# EAGLE design hoppercontroller (EAGLE 8.2.1)
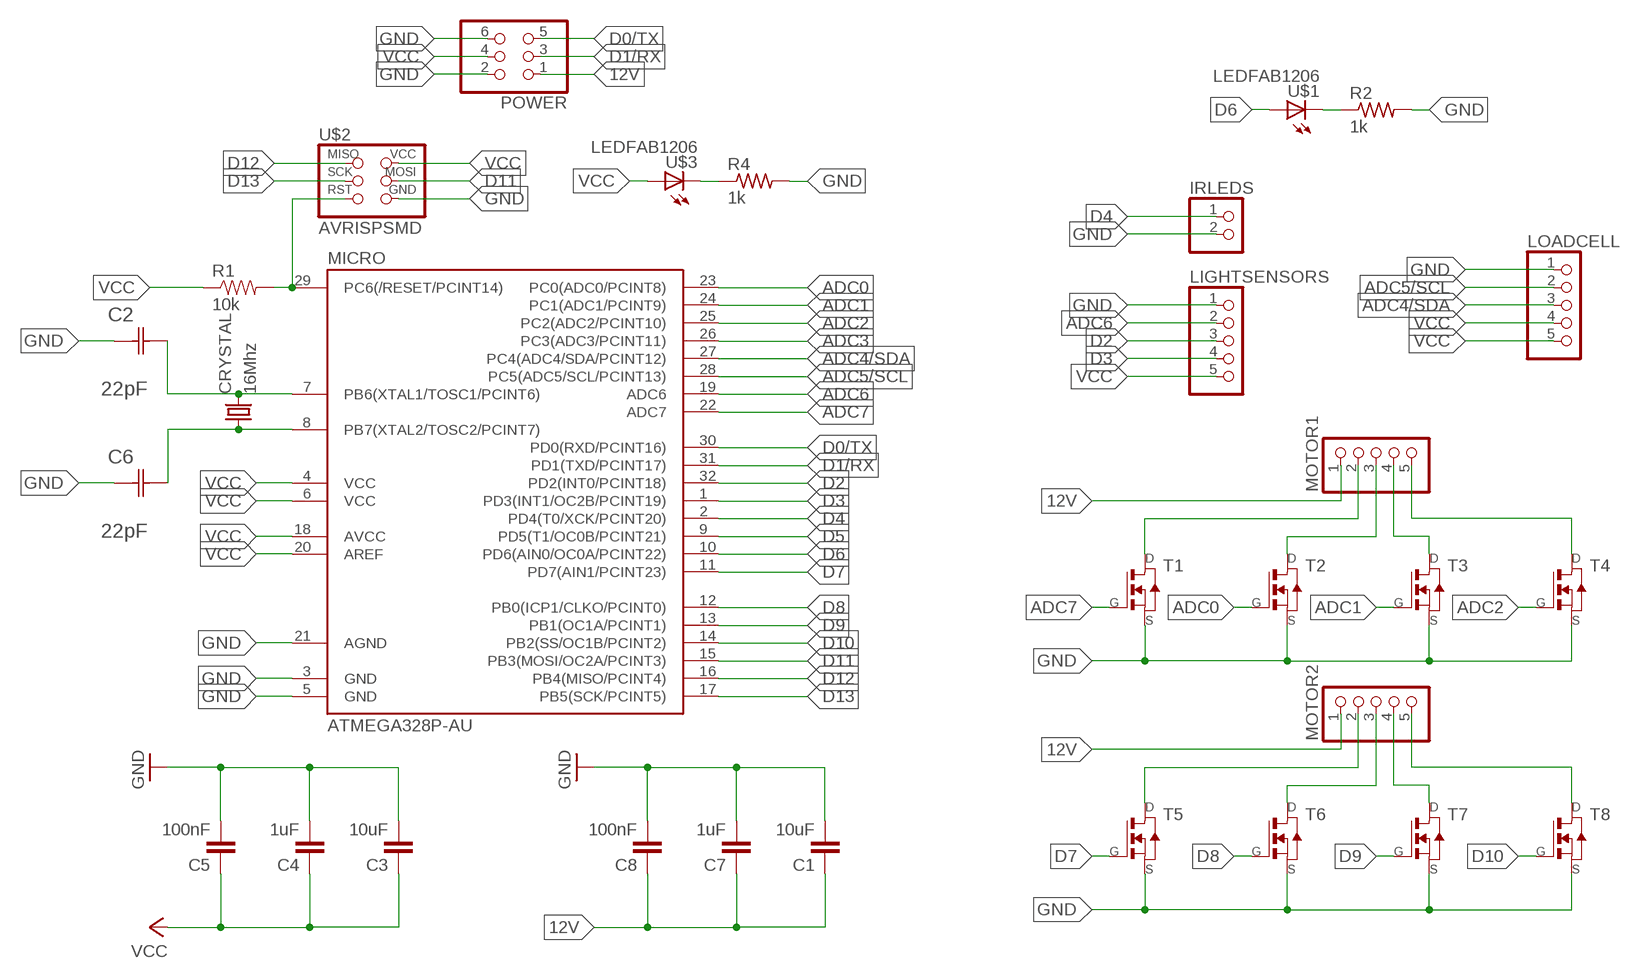
[diagram p0: schematic, sheet 1]

## Parts
C1  10uF  CAP1206  [1206]
C2  22pF  0612ZC225MAT2A  [CAPC3216X178N]
C3  10uF  CAP1206  [1206]
C4  1uF  CAP1206  [1206]
C5  100nF  CAP1206  [1206]
C6  22pF  0612ZC225MAT2A  [CAPC3216X178N]
C7  1uF  CAP1206  [1206]
C8  100nF  CAP1206  [1206]
CRYSTAL  16Mhz  CSM-7X-DU  [CSM-7X-DU]
IRLEDS  PINHD-1X2  [1X02]
LIGHTSENSORS  PINHD-1X5  [1X05]
LOADCELL  PINHD-1X5  [1X05]
MICRO  ATMEGA328P-AU  ATMEGA48/88/168-AU  [TQFP32-08]
MOTOR1  PINHD-1X5  [1X05]
MOTOR2  PINHD-1X5  [1X05]
POWER  PINHD-2X3-SMD  [2X03SMD]
R1  10k  RESISTOR1206  [1206]
R2  1k  RES-US1206FAB  [R1206FAB]
R4  1k  RES-US1206FAB  [R1206FAB]
T1  NMOSFETTO252  [TO252]
T2  NMOSFETTO252  [TO252]
T3  NMOSFETTO252  [TO252]
T4  NMOSFETTO252  [TO252]
T5  NMOSFETTO252  [TO252]
T6  NMOSFETTO252  [TO252]
T7  NMOSFETTO252  [TO252]
T8  NMOSFETTO252  [TO252]
U$1  LEDFAB1206  [LED1206FAB]
U$2  AVRISPSMD  [2X03SMD]
U$3  LEDFAB1206  [LED1206FAB]

## Nets
12V: C1.1 C7.1 C8.1 MOTOR1.1 MOTOR2.1 POWER.1
ADC0: MICRO.23(PC0(ADC0/PCINT8)) T2.1(G)
ADC1: MICRO.24(PC1(ADC1/PCINT9)) T3.1(G)
ADC2: MICRO.25(PC2(ADC2/PCINT10)) T4.1(G)
ADC3: MICRO.26(PC3(ADC3/PCINT11))
ADC4/SDA: LOADCELL.3 MICRO.27(PC4(ADC4/SDA/PCINT12))
ADC5/SCL: LOADCELL.2 MICRO.28(PC5(ADC5/SCL/PCINT13))
ADC6: LIGHTSENSORS.2 MICRO.19(ADC6)
ADC7: MICRO.22(ADC7) T1.1(G)
D0/TX: MICRO.30(PD0(RXD/PCINT16)) POWER.5
D1/RX: MICRO.31(PD1(TXD/PCINT17)) POWER.3
D2: LIGHTSENSORS.3 MICRO.32(PD2(INT0/PCINT18))
D3: LIGHTSENSORS.4 MICRO.1(PD3(INT1/OC2B/PCINT19))
D4: IRLEDS.1 MICRO.2(PD4(T0/XCK/PCINT20))
D5: MICRO.9(PD5(T1/OC0B/PCINT21))
D6: MICRO.10(PD6(AIN0/OC0A/PCINT22)) U$1.1(A)
D7: MICRO.11(PD7(AIN1/PCINT23)) T5.1(G)
D8: MICRO.12(PB0(ICP1/CLKO/PCINT0)) T6.1(G)
D9: MICRO.13(PB1(OC1A/PCINT1)) T7.1(G)
D10: MICRO.14(PB2(SS/OC1B/PCINT2)) T8.1(G)
D11: MICRO.15(PB3(MOSI/OC2A/PCINT3)) U$2.4(MOSI)
D12: MICRO.16(PB4(MISO/PCINT4)) U$2.1(MISO)
D13: MICRO.17(PB5(SCK/PCINT5)) U$2.3(SCK)
GND: C1.2 C2.1(C1) C3.2 C4.2 C5.2 C6.1(C1) C7.2 C8.2 IRLEDS.2 LIGHTSENSORS.1 LOADCELL.1 MICRO.3(GND) MICRO.5(GND) MICRO.21(AGND) POWER.2 POWER.6 R2.2 R4.2 T1.2(S) T2.2(S) T3.2(S) T4.2(S) T5.2(S) T6.2(S) T7.2(S) T8.2(S) U$2.6(GND)
N$1: MOTOR2.3 T6.3(D)
N$2: MOTOR1.3 T2.3(D)
N$3: MICRO.29(PC6(/RESET/PCINT14)) R1.2 U$2.5(RST)
N$4: C2.2(C2) CRYSTAL.2 MICRO.7(PB6(XTAL1/TOSC1/PCINT6))
N$5: MOTOR1.2 T1.3(D)
N$6: MOTOR1.4 T3.3(D)
N$7: R4.1 U$3.2(C)
N$8: MOTOR1.5 T4.3(D)
N$9: MOTOR2.2 T5.3(D)
N$10: MOTOR2.4 T7.3(D)
N$11: MOTOR2.5 T8.3(D)
N$12: C6.2(C2) CRYSTAL.1 MICRO.8(PB7(XTAL2/TOSC2/PCINT7))
N$13: R2.1 U$1.2(C)
VCC: C3.1 C4.1 C5.1 LIGHTSENSORS.5 LOADCELL.4 LOADCELL.5 MICRO.4(VCC) MICRO.6(VCC) MICRO.18(AVCC) MICRO.20(AREF) POWER.4 R1.1 U$2.2(VCC) U$3.1(A)

## Library data of the parts
C1 C3-C5 C7 C8 = 01_SparkFun:CAP: Capacitor Standard 0603 ceramic capacitor, and 0.1" leaded capacitor.
C2 C6 = AVX_By_element14_Batch_1:0612ZC225MAT2A: Capacitor 1206; MPN: 0612ZC225MAT2A; OC_FARNELL: -; OC_NEWARK: 12N3209; SUPPLIER: AVX; TOLERANCE: ±20%; VALUE: 2.2µF; VOLTAGERATING: 10V
CRYSTAL = 01_FAB_Hello:CSM-7X-DU: SMD CRYSTAL Source: www.ecsxtal.com .. Crystal 3.6864MHz CSM_7X_DU.PDF; OC_FARNELL: unknown; OC_NEWARK: unknown
IRLEDS = pinhead:PINHD-1X2: PIN HEADER
LIGHTSENSORS LOADCELL MOTOR1 MOTOR2 = pinhead:PINHD-1X5: PIN HEADER
MICRO = atmega8:ATMEGA48/88/168
POWER = fab:PINHD-2X3-SMD: PIN HEADER
R1 = 01_SparkFun:RESISTOR: Resistor Basic schematic elements and footprints for 0603, 1206, and PTH 1/10th watt (small) resistors.
R2 R4 = fab:RES-US: Resistor (US Symbol) Variants with postfix FAB are widened to allow the routing of internal traces
T1-T8 = fab:NMOSFET: MOS FET
U$1 U$3 = fab:LED: LED
U$2 = fab:AVRISP

## Board
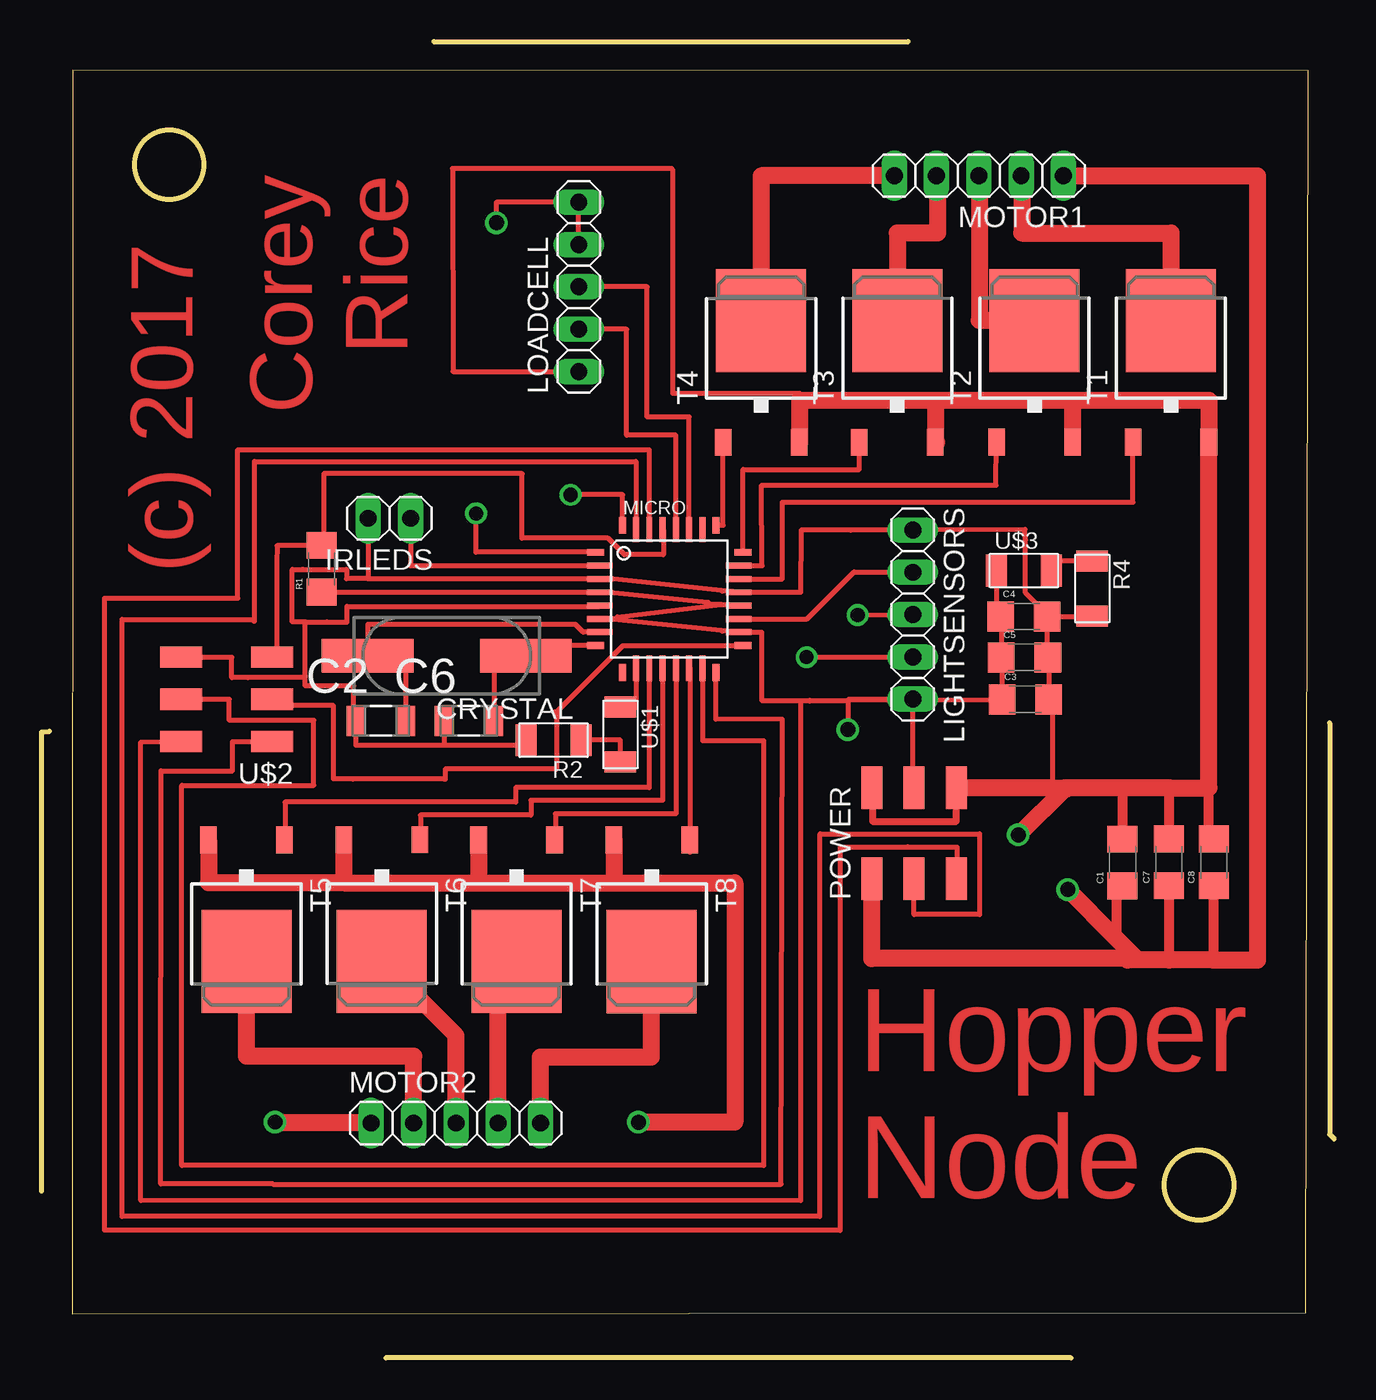
[diagram p1: board, top side]
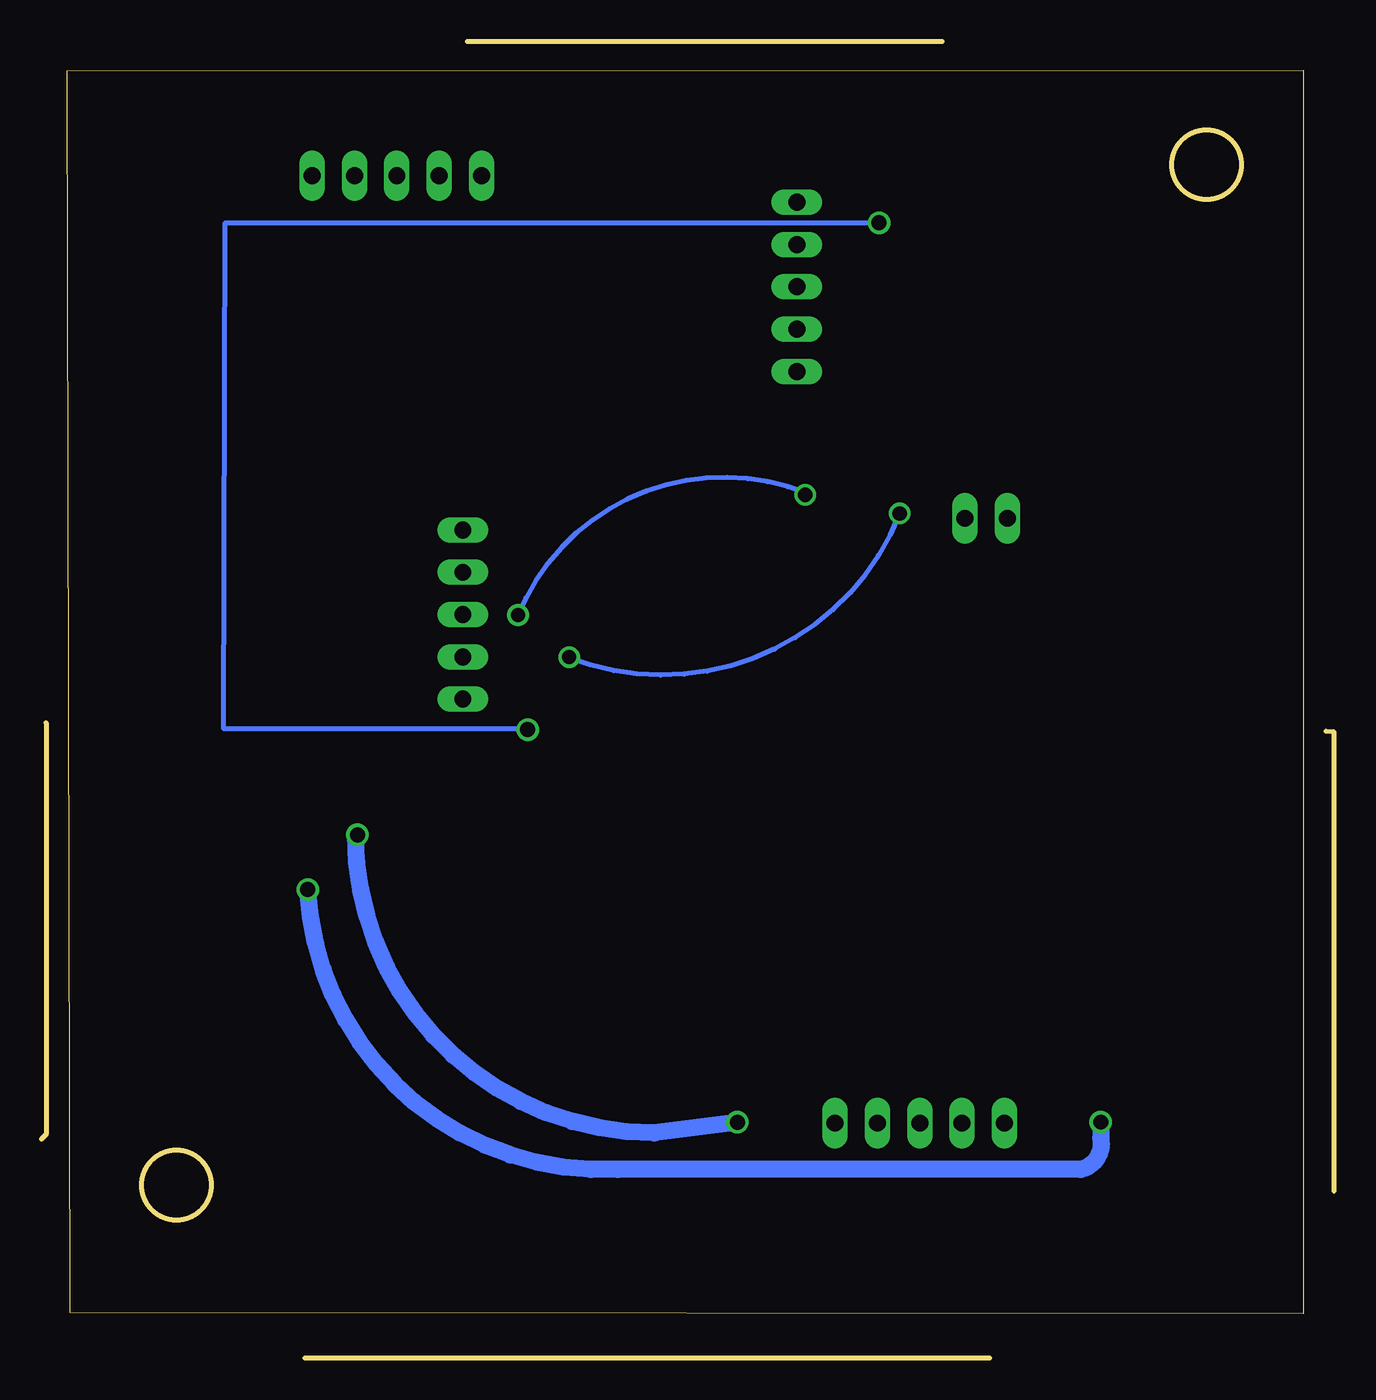
[diagram p2: board, bottom side, seen from below]

Size 77.6 x 79.03 mm. Coordinates in mm from the lower left corner, seen from the top.
Outline: 23.54,79.03 52.03,79.03
Outline: 77.33,38.13 77.33,13.41 77.6,13.15
Outline: 61.81,0 20.66,0
Outline: 0,10.02 0,37.57 0.48,37.62
Outline: 1.84,2.65 75.89,2.71 76.05,77.29 1.86,77.3 1.84,2.65
Outline: circle at 7.66,71.64 radius 2.08
Outline: circle at 69.5,10.38 radius 2.08
Copper layers (1*16): Top 0.035mm / dielectric 1.5mm / Bottom 0.035mm
Design rules "default *": minimum track width 12mil, minimum drill 24mil, track to track 16mil, track to pad 16mil, pad to pad 16mil, via to via 16mil, smd to smd 16mil, copper to edge 40mil, drill to drill 8mil, minimum pad ring 10mil, minimum via ring 8mil, stop-mask expansion 4mil, vias tented up to drill 0mil, thermal gap 10mil

### Footprints (pad centres in the part's own frame; a part is rotated, then mirrored left to right if it is on the bottom)
1206 = smd 1.6 x 1.8: 1 -1.4,0; 2 1.4,0
CAPC3216X178N = smd 1.118 x 1.803: 1 -1.499,0; 2 1.499,0
CSM-7X-DU = smd 5.5 x 2: 1 -4.75,0; 2 4.75,0
1X02 = drill 1.016 long: 1 -1.27,0; 2 1.27,0
1X05 = drill 1.016 long: 1 -5.08,0; 2 -2.54,0; 3 0,0; 4 2.54,0; 5 5.08,0
TQFP32-08 = smd 1.016 x 0.406: 1 -4.42,2.8; 8 -4.42,-2.8; 17 4.42,-2.8; 24 4.42,2.8 | smd 1.524 x 0.356: 2 -4.166,2; 3 -4.166,1.2; 4 -4.166,0.4; 5 -4.166,-0.4; 6 -4.166,-1.2; 7 -4.166,-2; 18 4.166,-2; 19 4.166,-1.2; 20 4.166,-0.4; 21 4.166,0.4; 22 4.166,1.2; 23 4.166,2 | smd 0.406 x 1.016: 9 -2.8,-4.42; 16 2.8,-4.42; 25 2.8,4.42; 32 -2.8,4.42 | smd 0.356 x 1.524: 10 -2,-4.166; 11 -1.2,-4.166; 12 -0.4,-4.166; 13 0.4,-4.166; 14 1.2,-4.166; 15 2,-4.166; 26 2,4.166; 27 1.2,4.166; 28 0.4,4.166; 29 -0.4,4.166; 30 -1.2,4.166; 31 -2,4.166
2X03SMD = smd 2.54 x 1.27: 1 -2.54,2.54; 2 2.92,2.54; 3 -2.54,0; 4 2.92,0; 5 -2.54,-2.54; 6 2.92,-2.54
R1206FAB = smd 1.27 x 1.905: 1 -1.651,0; 2 1.651,0
TO252 = smd 1 x 1.6: 1 -2.28,-4.8; 2 2.28,-4.8 | smd 5.4 x 6.2: 3 0,2.5
LED1206FAB = smd 1.27 x 1.905: 1 -1.651,0; 2 1.651,0

### Placement (x,y rotation side)
C1  64.9,29.74 90 top
C2  20.37,38.24 0 top
C3  59.06,39.54 0 top
C4  58.98,44.51 0 top
C5  59.02,42.06 0 top
C6  25.65,38.24 0 top
C7  67.68,29.75 90 top
C8  70.38,29.75 90 top
CRYSTAL  24.33,42.16 180 top
IRLEDS  20.88,50.41 180 top
LIGHTSENSORS  52.31,44.63 270 top
LOADCELL  32.25,64.31 90 top
MICRO  37.68,45.57 0 top
MOTOR1  56.27,70.98 180 top
MOTOR2  24.87,14.1 0 top
POWER  52.38,31.31 90 top
R1  16.81,47.38 90 top
R2  30.74,37.09 180 top
R4  63.08,46.18 270 top
T1  67.8,59.78 0 top
T2  59.61,59.78 0 top
T3  51.38,59.78 0 top
T4  43.2,59.77 0 top
T5  12.3,26.3 180 top
T6  20.42,26.3 180 top
T7  28.51,26.3 180 top
T8  36.63,26.29 180 top
U$1  34.75,37.42 270 top
U$2  11.3,39.54 180 top
U$3  58.97,47.27 0 top

### Tracks (layer width: path | path; a pad name or v marks a point on that pad's centre or on a via)
12V  (via drill 0.9)
  Top 0.61: C1.1 64.54,28.34 64.54,25.17 | C7.1 67.69,28.35 67.69,23.89 | C8.1 70.33,28.35 70.33,23.89
  Top 1.016: 65.21,23.98 65.72,23.98 | 65.21,23.98 49.84,23.98 POWER.1 | MOTOR2.1 14.07,14.1 arc-90 v14.01,14.16 | 65.46,24.25 arc90 65.72,23.98 | 65.21,23.98 65.21,23.89 67.69,23.89 70.33,23.89 73,23.89 73,70.98 MOTOR1.1 | 65.72,23.98 64.54,25.17 v61.61,28.11
  Bottom 1.016: v14.01,14.16 14.01,13.19 arc90 15.22,11.32 42.99,11.32 arc90 v61.61,28.11
ADC0
  Top 0.305: MICRO.23 43.25,47.57 43.23,52.4 57.31,52.4 T2.1
ADC1
  Top 0.305: MICRO.24 42.12,48.37 42.12,53.34 49.1,53.34 T3.1
ADC2
  Top 0.305: MICRO.25 40.92,49.99 T4.1
ADC4/SDA
  Top 0.305: MICRO.27 38.88,56.5 36.36,56.5 36.36,64.31 LOADCELL.3
ADC5/SCL
  Top 0.305: MICRO.28 38.08,55.4 35.13,55.4 35.13,61.77 LOADCELL.2
ADC6
  Top 0.305: MICRO.19 45.95,44.37 48.77,47.19 52.31,47.19 LIGHTSENSORS.2
ADC7
  Top 0.305: MICRO.22 44.47,46.77 44.47,51.38 65.52,51.38 T1.1
D0/TX
  Top 0.305: MICRO.30 36.48,54.52 11.77,54.52 11.77,45.61 3.77,45.61 3.78,7.67 47.96,7.65 47.96,30.68 52,30.69 54.96,30.67 POWER.5
D1/RX
  Top 0.305: MICRO.31 35.68,53.82 12.78,53.82 12.78,44.23 12.74,44.23 12.74,44.34 4.83,44.34 4.84,8.49 46.72,8.49 46.73,31.46 56.31,31.46 56.31,26.62 52.38,26.62 POWER.3
D2  (via drill 0.85 pad 1.3)
  Top 0.305: MICRO.32 34.88,51.82 v31.75,51.82 | v49,44.6 LIGHTSENSORS.3
  Bottom 0.305: v31.75,51.82 31.63,51.89 arc-90 49.04,44.51 49.1,44.46 arc-90 v49,44.6
D3  (via drill 0.85 pad 1.3)
  Top 0.305: MICRO.1 26.08,48.37 v26.08,50.7 | v45.93,42.07 LIGHTSENSORS.4
  Bottom 0.305: v26.08,50.7 arc90 45.97,42.06 v45.93,42.07
D4
  Top 0.305: IRLEDS.1 22.15,47.61 22.14,47.57 MICRO.2
D6
  Top 0.305: MICRO.10 35.68,39.07 U$1.1
D7
  Top 0.305: MICRO.11 36.48,34.24 28.46,34.24 28.46,33.37 14.61,33.37 14.61,31.1 T5.1
D8
  Top 0.305: MICRO.12 37.28,33.48 29.38,33.48 29.38,32.6 22.74,32.6 22.74,31.1 T6.1
D9
  Top 0.305: MICRO.13 38.08,32.67 30.84,32.67 30.84,31.1 T7.1
D10
  Top 0.305: MICRO.14 38.94,41.4 38.94,30.36 38.91,30.36 T8.1
D11
  Top 0.305: 39.72,41.4 MICRO.15 39.68,37.06 43.34,37.06 43.34,11.55 8.42,11.55 8.42,34.37 16.33,34.37 16.33,38.28 11.27,38.28 11.27,39.54 U$2.4
D12
  Top 0.305: 40.52,41.15 MICRO.16 40.48,38.35 44.47,38.34 44.4,10.42 13.9,10.43 13.9,10.44 7.15,10.44 7.18,35.24 11.47,35.24 11.47,37 | 11.47,37 | 11.47,37 U$2.1
D13
  Top 0.305: 13.27,39.58 13.32,39.54 U$2.3 13.84,39.16 17.53,39.16 17.53,34.76 18.68,34.75 24.22,34.75 | 24.19,34.77 24.14,34.76 24.22,34.75 | MICRO.17 34.88,42.75 30.91,38.79 | 30.91,38.79 30.81,38.79 | 30.91,38.79 30.91,35.35 24.22,35.35 24.22,34.75
GND  (via drill 0.9)
  Top 0.305: MICRO.21 | 15.82,40.94 15.82,40.86 12.38,40.84 11.41,40.85 11.41,42.06 8.4,42.06 U$2.6 | 15.82,40.94 15.82,44.18 | 15.82,44.18 17.14,44.18 18.33,44.18 18.33,45.11 33.45,45.1 MICRO.5 | 15.82,44.18 15.04,44.18 15.05,47.34 15.66,47.34 15.68,47.34 18.3,47.33 18.3,46.78 19.6,46.78 | 19.6,46.78 33.52,46.78 | MICRO.3 33.52,46.78 | MICRO.21 41.24,46.03 40.85,46.03 40.81,46.08 34.07,46.78 33.52,46.78 | C3.2 60.46,42.06 C5.2 60.38,42.06 C4.2 | C3.2 60.52,39.54 | C6.1 24.16,36.78 | 24.16,36.78 18.87,36.78 C2.1 18.74,38.25 18.74,40.35 15.82,40.35 15.82,40.94 | C4.2 60.38,44.62 59.06,45.93 59.06,49.12 59.05,49.75 48.58,49.69 | 48.58,49.69 45.59,49.69 45.57,45.96 MICRO.21 | C4.2 63.08,44.51 R4.2 | IRLEDS.2 19.6,46.78 | LIGHTSENSORS.1 48.58,49.69 | 48.58,49.69 | C3.2 60.49,39.54 | C3.2 60.68,39.54 60.68,34.23 | 45.52,57.5 45.52,57.9 37.9,57.9 37.9,71.34 37.85,71.34 37.82,71.4 24.66,71.4 24.69,59.23 LOADCELL.1 | R2.2 29.09,36.78 24.16,36.78
  Top 0.406: POWER.2 49.89,34.19 49.89,32.22 54.92,32.22 POWER.6
  Top 0.61: C1.2 64.92,31.14 64.92,34.23 | C7.2 67.72,31.15 67.72,34.23 | C8.2 70.08,31.15 70.08,34.23
  Top 1.016: 45.5,54.97 T4.2 45.52,54.97 45.52,57.5 53.66,57.5 | 53.74,54.98 T3.2 53.66,57.5 | 61.5,34.23 60.68,34.23 POWER.6 | T5.2 10.02,28.52 18.14,28.52 | 18.14,28.52 26.23,28.52 | 26.23,28.52 34.4,28.52 | 34.4,28.52 34.4,31.09 T8.2 | T7.2 26.23,28.52 | T6.2 18.14,28.52 | 34.4,28.52 41.62,28.52 41.62,14.15 v35.83,14.15 | 61.26,33.99 arc-90 61.5,34.23 | T1.2 | 61.5,34.16 61.5,34.23 | 53.66,57.5 61.89,57.5 | 61.89,57.5 T2.2 | 61.89,57.5 70.08,57.5 T1.2 | T1.2 70.08,34.23 67.72,34.23 64.92,34.23 61.5,34.23 | 61.5,34.23 v58.63,31.4
  Bottom 1.016: v35.83,14.15 40.82,13.51 arc90 58.75,31.44 58.58,31.25 arc90 v58.63,31.4
N$1
  Top 1.016: MOTOR2.3 24.87,19.35 T6.3
N$2
  Top 1.016: MOTOR1.3 56.29,70.98 56.29,62.3 59.61,62.3 T2.3
N$3
  Top 0.305: 13.88,42.08 U$2.5 14.12,42.37 14.12,47.68 14.12,47.69 14.13,48.77 R1.2 | R1.2 16.81,48.79 | MICRO.29 37.33,49.73 37.33,48.22 35,48.22 34,49.22 28.89,49.22 28.84,49.22 28.85,53.08 16.94,53.08 16.94,48.78 R1.2
N$4
  Top 0.305: MICRO.7 32.51,43.57 32.04,44.03 19.58,44.03 CRYSTAL.2 21.87,42.16 C2.2
N$5
  Top 1.016: MOTOR1.2 58.84,70.98 58.84,67.54 67.8,67.54 T1.3
N$6
  Top 1.016: MOTOR1.4 53.78,70.98 53.78,67.54 51.38,67.54 T3.3
N$7
  Top 0.305: R4.1 60.62,47.84 U$3.2
N$8
  Top 1.016: MOTOR1.5 43.2,70.98 T4.3
N$9
  Top 1.016: MOTOR2.2 22.33,18.12 12.3,18.12 T5.3 | T5.3
N$10
  Top 1.016: MOTOR2.4 27.41,22.9 arc-90 27.51,23 27.71,23 arc90 T7.3
N$11
  Top 1.016: MOTOR2.5 29.95,18.07 36.61,18.07 36.61,23.79 T8.3
N$12
  Top 0.305: MICRO.8 29.08,42.77 CRYSTAL.1 27.15,42.16 C6.2
N$13
  Top 0.305: U$1.2 34.75,37.09 R2.1
VCC  (via drill 0.9)
  Top 0.305: MICRO.18 | 41.85,43.54 MICRO.18 | MICRO.20 41.23,45.23 40.8,45.23 | 40.8,45.23 40.15,45.23 40.02,45.35 34.07,45.96 MICRO.4 R1.1 | 33.73,44.39 MICRO.6 | 40.8,45.23 34.57,44.49 34.51,44.43 34.19,44.39 33.73,44.39 | MICRO.18 41.22,43.63 40.85,43.63 40.81,43.67 33.73,44.39 | 57.58,44.63 C4.1 | C4.1 57.62,44.51 C5.1 57.66,42.06 C3.1 | 52.31,39.51 48.41,39.48 | 52.31,39.51 C3.1 | 46.11,39.48 43.23,39.48 43.23,43.57 MICRO.18 | 46.11,39.48 48.41,39.48 | U$3.1 57.32,44.51 C4.1 | LIGHTSENSORS.5 48.41,39.53 48.41,39.48 | C3.1 57.95,39.54 | 46.11,39.48 46.11,39.43 45.56,39.43 45.57,9.44 5.96,9.45 5.96,36.97 U$2.2 | POWER.4 52.31,34.23 52.31,39.51 | 48.41,39.48 v48.41,37.72 | v27.31,68.15 27.31,69.39 LOADCELL.5 LOADCELL.4
  Bottom 0.305: v48.41,37.72 48.41,37.77 66.66,37.77 66.57,68.15 v27.31,68.15

### Text on the board
Top: Corey / Rice | (c) 2017 | Hopper / Node